# EAGLE design devboard (EAGLE 9.0.1)

## Sheet 1 of 2
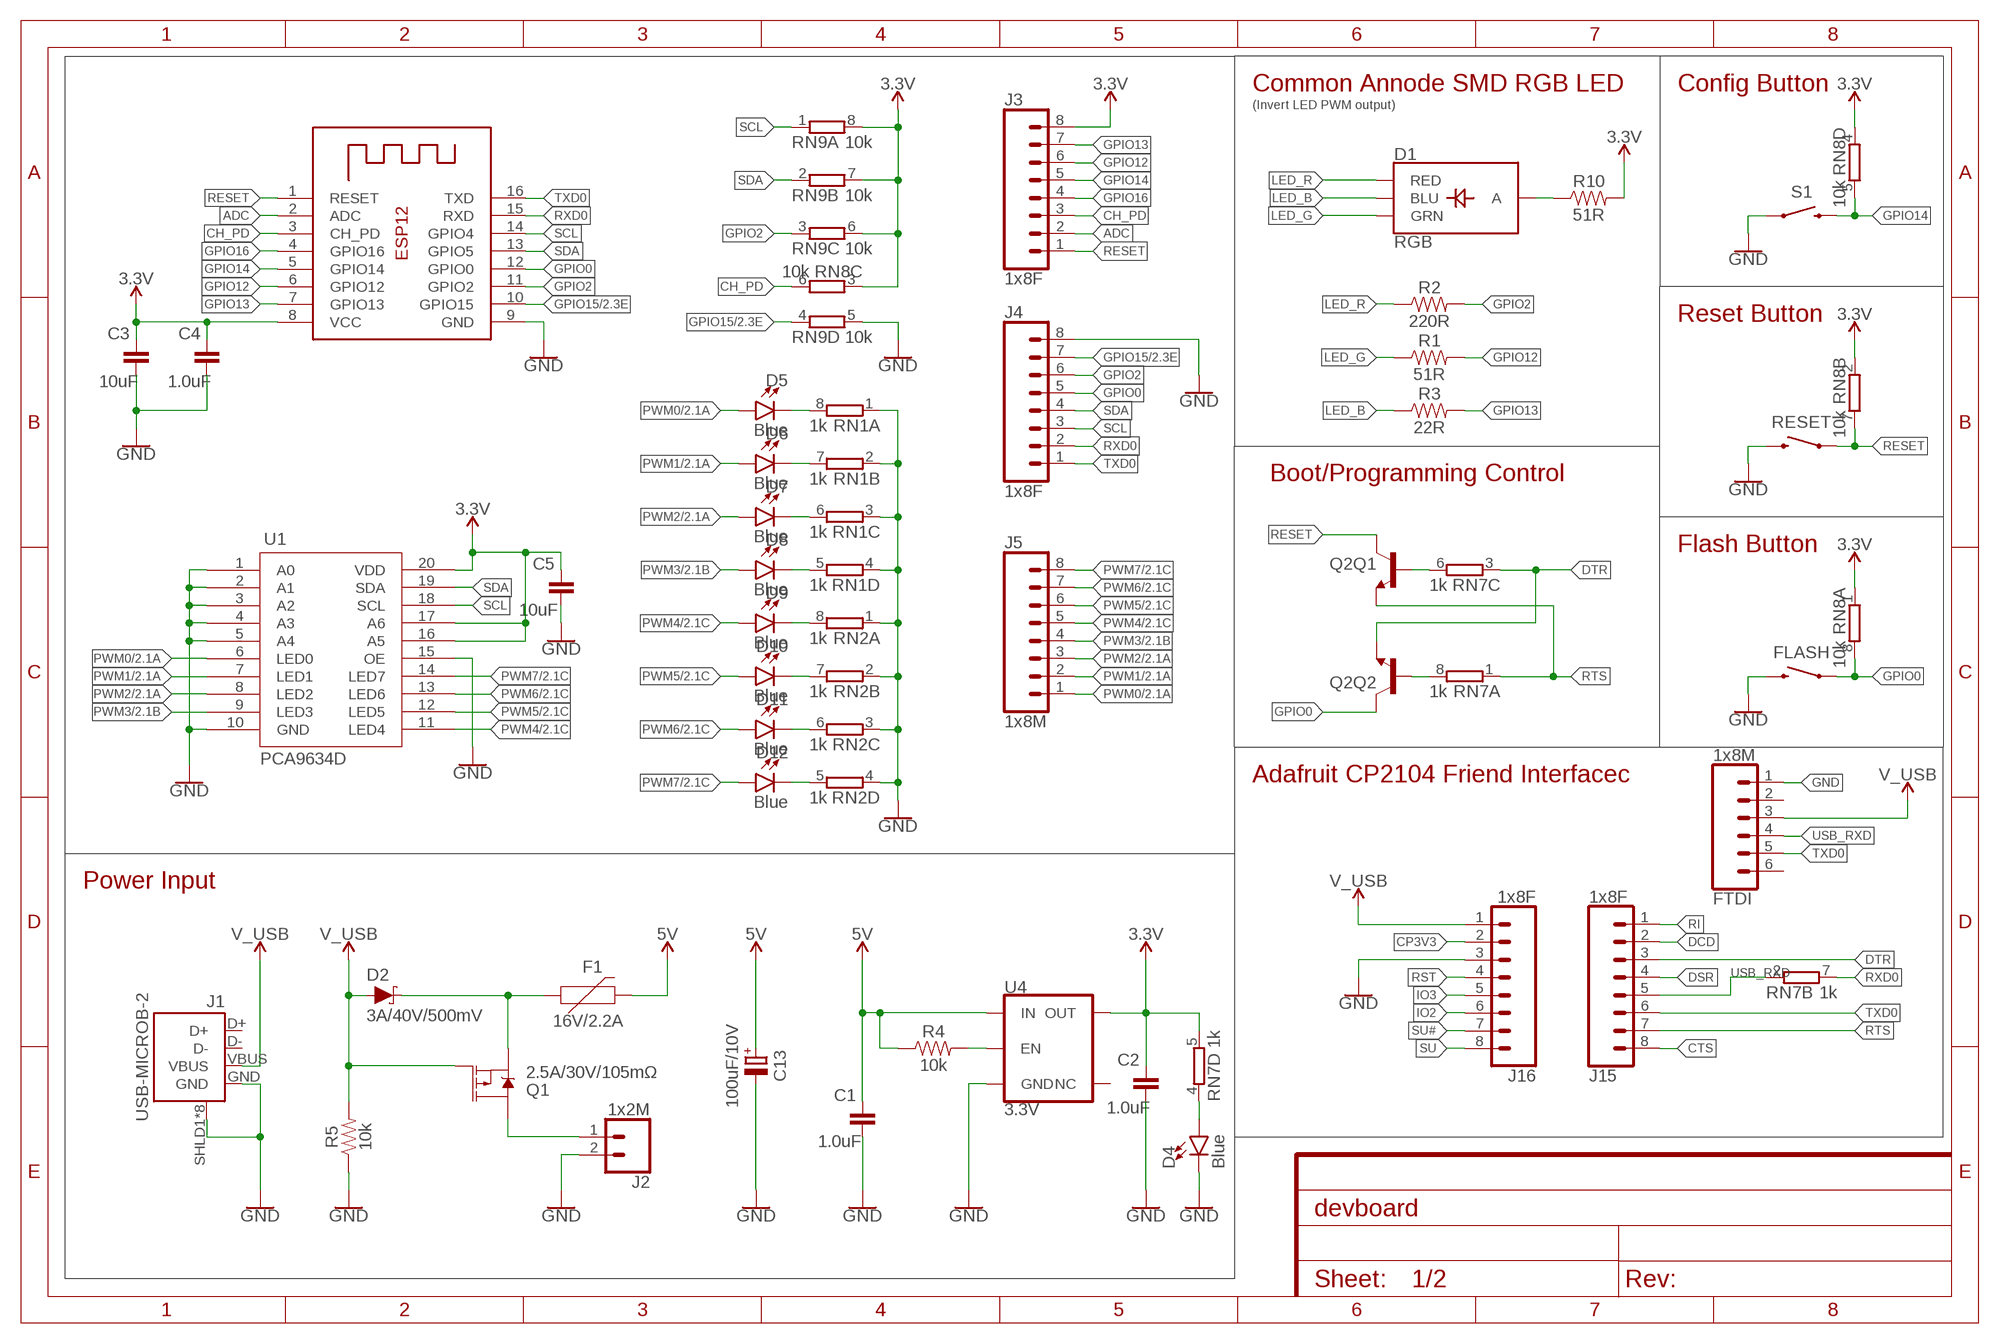
[diagram p0: schematic, sheet 1]
FRAME1 (FRAME-A4L): CNAME: VibHub ESP8266 Devboard; CREVISION: 0.1; DESIGNER: Kadah

### Parts
C1  1.0uF  CAPACITOR-0805  [C0805]
C2  1.0uF  CAPACITOR-0805  [C0805]
C3  10uF  CAPACITOR-0805  [C0805]
C4  1.0uF  CAPACITOR-0805  [C0805]
C5  10uF  CAPACITOR-0805  [C0805]
C13  100uF/10V  CAPACITOR_POLPANASONIC_D  [PANASONIC_D]
D1  RGB  LED-RGB-CAPLCC  [P-LCC-4-3]
D2  3A/40V/500mV  DIODE-SCHOTTKY-B340A  [SMA-DIODE]
D4  Blue  LED0805-NO_OUTLINE  [CHIPLED_0805_NOOUTLINE]
D5  Blue  LED0805-NO_OUTLINE  [CHIPLED_0805_NOOUTLINE]
D6  Blue  LED0805-NO_OUTLINE  [CHIPLED_0805_NOOUTLINE]
D7  Blue  LED0805-NO_OUTLINE  [CHIPLED_0805_NOOUTLINE]
D8  Blue  LED0805-NO_OUTLINE  [CHIPLED_0805_NOOUTLINE]
D9  Blue  LED0805-NO_OUTLINE  [CHIPLED_0805_NOOUTLINE]
D10  Blue  LED0805-NO_OUTLINE  [CHIPLED_0805_NOOUTLINE]
D11  Blue  LED0805-NO_OUTLINE  [CHIPLED_0805_NOOUTLINE]
D12  Blue  LED0805-NO_OUTLINE  [CHIPLED_0805_NOOUTLINE]
F1  16V/2.2A  PPTC1812  [FUSC7035X90]
FLASH  MOMENTARY-SWITCH-SPST-SMD-6.0X3.5MM  [TACTILE_SWITCH_SMD_6.0X3.5MM]
FTDI  1x8M  CONN_06LOCK  [1X06_LOCK]
J1  USB-MICROB-2  [USB-MICROB-10118194]
J2  1x2M  CONN_02LOCK_LONGPADS  [1X02_LOCK_LONGPADS]
J3  1x8F  CONN_08FEMALE_LOCK  [1X08_FEMALE_LOCK]
J4  1x8F  CONN_08FEMALE_LOCK  [1X08_FEMALE_LOCK]
J5  1x8M  CONN_08LOCK  [1X08_LOCK]
J15  1x8F  CONN_08FEMALE_LOCK  [1X08_FEMALE_LOCK]
J16  1x8F  CONN_08FEMALE_LOCK  [1X08_FEMALE_LOCK]
Q1  2.5A/30V/105mΩ  MOSFET_PCH-DMG2307L  [SOT23-3]
Q2  TRANS_NPN_DUAL-MBT3904DW1T1  [SC70-6]
R1  51R  RESISTOR0805  [0805]
R2  220R  RESISTOR0805  [0805]
R3  22R  RESISTOR0805  [0805]
R4  10k  RESISTOR0805  [0805]
R5  10k  RESISTOR0805  [0805]
R10  51R  RESISTOR0805  [0805]
RESET  MOMENTARY-SWITCH-SPST-SMD-6.0X3.5MM  [TACTILE_SWITCH_SMD_6.0X3.5MM]
RN1  1k  4R-NEXB28V  [EXB28V]
RN2  1k  4R-NEXB28V  [EXB28V]
RN7  1k  4R-NEXB28V  [EXB28V]
RN8  10k  4R-NEXB28V  [EXB28V]
RN9  10k  4R-NEXB28V  [EXB28V]
S1  MOMENTARY-SWITCH-SPST-PTH-6.0MM  [TACTILE_SWITCH_PTH_6.0MM]
U1  PCA9634D  PCA963420-SO  [SOIC127P1032X265-20]
U4  3.3V  V_REG_AP2112K-3.3V  [SOT23-5]
X1  ESP12  ESP-12  [ESP-12]

### Nets
3.3V: C2.1 C3.1 C4.1 C5.1 J3.8 R10.2 RN7.5 RN8.1 RN8.2 RN8.3 RN8.4 RN9.6 RN9.7 RN9.8 U1.16(A5) U1.17(A6) U1.20(VDD) U4.5(OUT) X1.8(VCC) ; also sheet 2
5V: C1.1 C13.+ F1.2 R4.1 U4.1(IN) ; also sheet 2
ADC: J3.2 X1.2(ADC)
CH_PD: J3.3 RN8.6 X1.3(CH_PD)
CP3V3: J16.2
CTS: J15.8
DCD: J15.2
DSR: J15.4
DTR: J15.3 Q2.1(Q2:E) RN7.3
GND: C1.2 C2.2 C3.2 C4.2 C5.2 C13.- D4.C FLASH.2 FTDI.1 J1.GND J1.SHLD1(SHIELD) J1.SHLD2(SHIELD) J1.SHLD3(SHIELD) J1.SHLD4(SHIELD) J1.SHLD5(SHIELD) J1.SHLD6(SHIELD) J1.SHLD7(SHIELD) J1.SHLD8(SHIELD) J2.2 J4.8 J16.3 R5.1 RESET.2 RN1.1 RN1.2 RN1.3 RN1.4 RN2.1 RN2.2 RN2.3 RN2.4 RN9.5 S1.1 U1.1(A0) U1.2(A1) U1.3(A2) U1.4(A3) U1.5(A4) U1.10(GND) U1.15(OE) U4.2(GND) X1.9(GND) ; also sheet 2
GPIO0: FLASH.1 J4.5 Q2.6(Q2:C) RN8.8 X1.12(GPIO0)
GPIO2: J4.6 R2.2 RN9.3 X1.11(GPIO2)
GPIO12: J3.6 R1.2 X1.6(GPIO12)
GPIO13: J3.7 R3.2 X1.7(GPIO13)
GPIO14: J3.5 RN8.5 S1.3 X1.5(GPIO14)
GPIO15: J4.7 RN9.4 X1.10(GPIO15) ; also sheet 2
GPIO16: J3.4 X1.4(GPIO16)
IO2: J16.6
IO3: J16.5
LED_B: D1.3(BLU) R3.1
LED_G: D1.2(GRN) R1.1
LED_R: D1.1(RED) R2.1
N$1: R4.2 U4.3(EN)
N$2: D5.C RN1.8
N$3: D6.C RN1.7
N$4: J2.1 Q1.3(D)
N$5: D2.C F1.1 Q1.2(S)
N$6: D7.C RN1.6
N$7: D8.C RN1.5
N$8: D9.C RN2.8
N$9: D10.C RN2.7
N$10: D11.C RN2.6
N$11: D12.C RN2.5
N$12: D1.4(A) R10.1
N$35: Q2.2(Q2:B) RN7.8
N$36: Q2.5(Q1:B) RN7.6
PWM0: D5.A J5.1 U1.6(LED0) ; also sheet 2
PWM1: D6.A J5.2 U1.7(LED1) ; also sheet 2
PWM2: D7.A J5.3 U1.8(LED2) ; also sheet 2
PWM3: D8.A J5.4 U1.9(LED3) ; also sheet 2
PWM4: D9.A J5.5 U1.11(LED4) ; also sheet 2
PWM5: D10.A J5.6 U1.12(LED5) ; also sheet 2
PWM6: D11.A J5.7 U1.13(LED6) ; also sheet 2
PWM7: D12.A J5.8 U1.14(LED7) ; also sheet 2
PWR_LED: D4.A RN7.4
RESET: J3.1 Q2.3(Q1:C) RESET.1 RN8.7 X1.1(RESET)
RI: J15.1
RST: J16.4
RTS: J15.7 Q2.4(Q1:E) RN7.1
RXD0: J4.2 RN7.7 X1.15(RXD)
SCL: J4.3 RN9.1 U1.18(SCL) X1.14(GPIO4)
SDA: J4.4 RN9.2 U1.19(SDA) X1.13(GPIO5)
SU: J16.8
SU#: J16.7
TXD0: FTDI.5 J4.1 J15.6 X1.16(TXD)
USB_RXD: FTDI.4 J15.5 RN7.2
V_USB: D2.A FTDI.3 J1.VBUS J16.1 Q1.1(G) R5.2
Unconnected: FTDI.2 FTDI.6 J1.D+ J1.D- U4.4(NC)

### Notes on the sheet
- Common Annode SMD RGB LED | Config Button
- (Invert LED PWM output)
- Reset Button
- Boot/Programming Control
- Flash Button
- Adafruit CP2104 Friend Interfacec
- Power Input

## Sheet 2 of 2
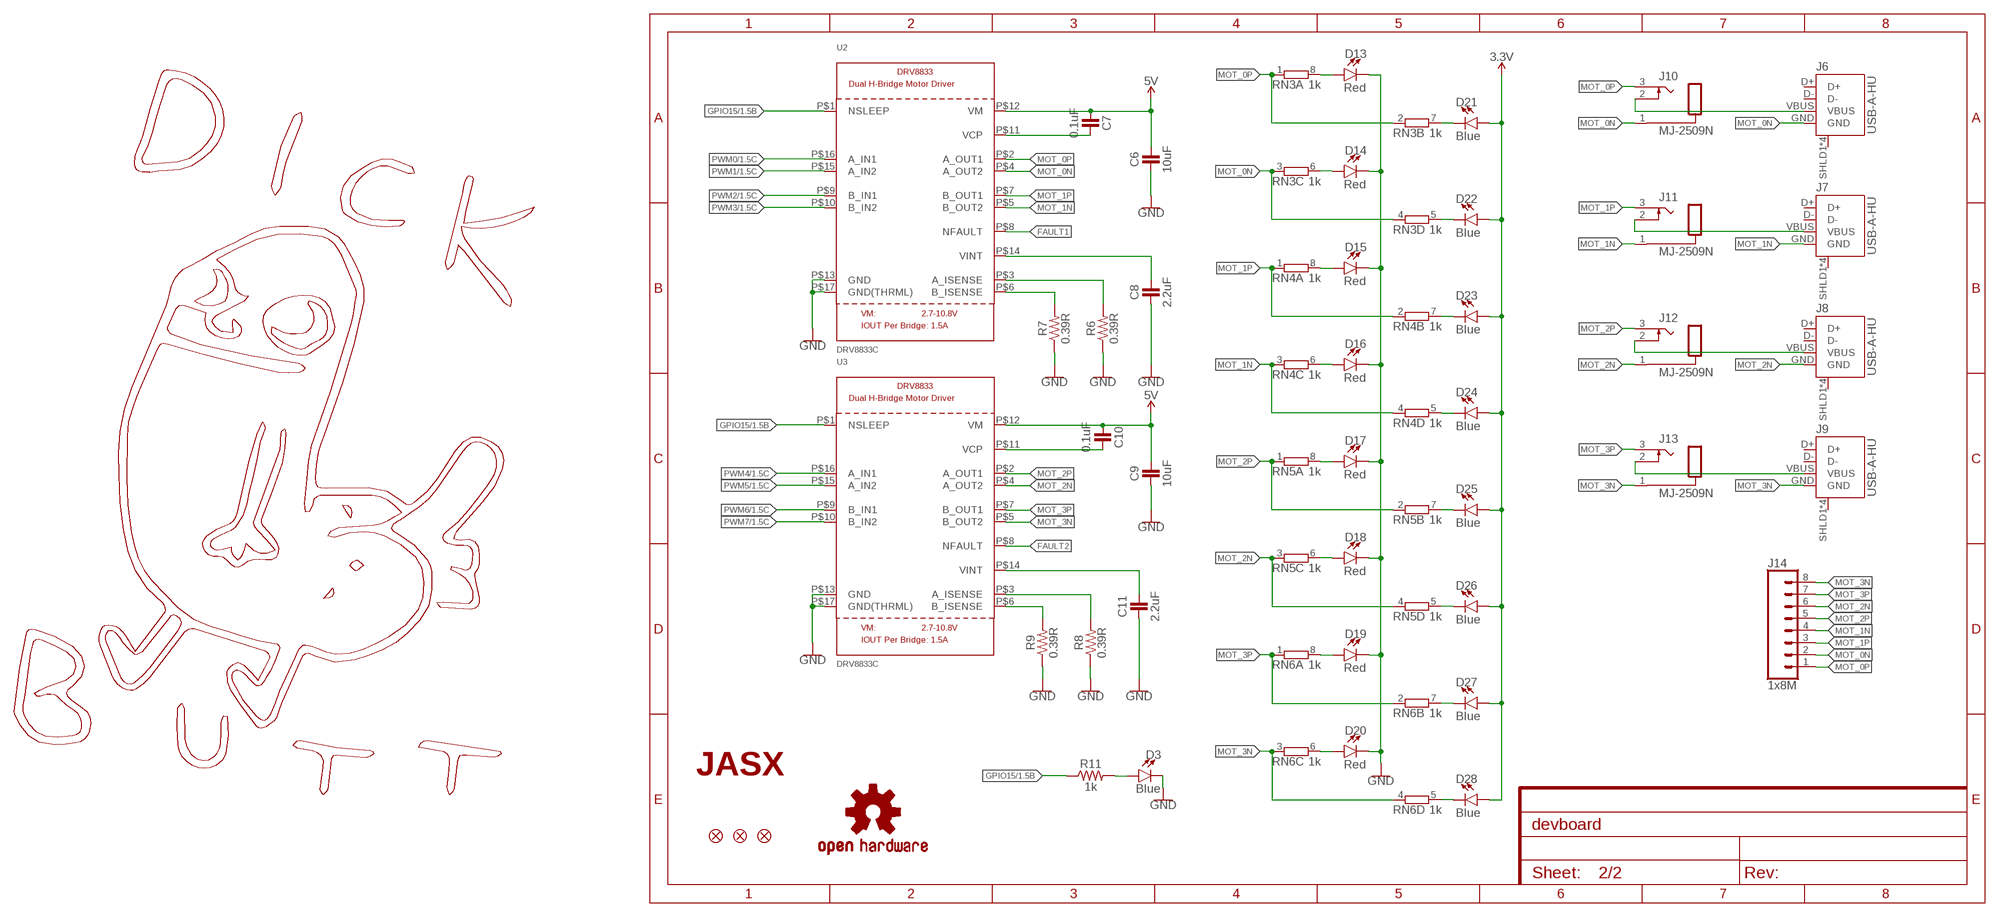
[diagram p1: schematic, sheet 2]

### Parts
C6  10uF  CAPACITOR-0805  [C0805]
C7  0.1uF  CAPACITOR-0805  [C0805]
C8  2.2uF  CAPACITOR-0805  [C0805]
C9  10uF  CAPACITOR-0805  [C0805]
C10  0.1uF  CAPACITOR-0805  [C0805]
C11  2.2uF  CAPACITOR-0805  [C0805]
D3  Blue  LED0805-NO_OUTLINE  [CHIPLED_0805_NOOUTLINE]
D13  Red  LED0805-NO_OUTLINE  [CHIPLED_0805_NOOUTLINE]
D14  Red  LED0805-NO_OUTLINE  [CHIPLED_0805_NOOUTLINE]
D15  Red  LED0805-NO_OUTLINE  [CHIPLED_0805_NOOUTLINE]
D16  Red  LED0805-NO_OUTLINE  [CHIPLED_0805_NOOUTLINE]
D17  Red  LED0805-NO_OUTLINE  [CHIPLED_0805_NOOUTLINE]
D18  Red  LED0805-NO_OUTLINE  [CHIPLED_0805_NOOUTLINE]
D19  Red  LED0805-NO_OUTLINE  [CHIPLED_0805_NOOUTLINE]
D20  Red  LED0805-NO_OUTLINE  [CHIPLED_0805_NOOUTLINE]
D21  Blue  LED0805-NO_OUTLINE  [CHIPLED_0805_NOOUTLINE]
D22  Blue  LED0805-NO_OUTLINE  [CHIPLED_0805_NOOUTLINE]
D23  Blue  LED0805-NO_OUTLINE  [CHIPLED_0805_NOOUTLINE]
D24  Blue  LED0805-NO_OUTLINE  [CHIPLED_0805_NOOUTLINE]
D25  Blue  LED0805-NO_OUTLINE  [CHIPLED_0805_NOOUTLINE]
D26  Blue  LED0805-NO_OUTLINE  [CHIPLED_0805_NOOUTLINE]
D27  Blue  LED0805-NO_OUTLINE  [CHIPLED_0805_NOOUTLINE]
D28  Blue  LED0805-NO_OUTLINE  [CHIPLED_0805_NOOUTLINE]
FD1  FIDUCIAL1X2  [FIDUCIAL-1X2]
FD2  FIDUCIAL1X2  [FIDUCIAL-1X2]
FD3  FIDUCIAL1X2  [FIDUCIAL-1X2]
J6  USB-A-HU  [USB-A-HU]
J7  USB-A-HU  [USB-A-HU]
J8  USB-A-HU  [USB-A-HU]
J9  USB-A-HU  [USB-A-HU]
J10  MJ-2509N  [MJ-2509N]
J11  MJ-2509N  [MJ-2509N]
J12  MJ-2509N  [MJ-2509N]
J13  MJ-2509N  [MJ-2509N]
J14  1x8M  CONN_08LOCK  [1X08_LOCK]
LOGO1  OSHW-LOGOM  [OSHW-LOGO-M]
R6  0.39R  RESISTOR0805  [0805]
R7  0.39R  RESISTOR0805  [0805]
R8  0.39R  RESISTOR0805  [0805]
R9  0.39R  RESISTOR0805  [0805]
R11  1k  RESISTOR0805  [0805]
RN3  1k  4R-NEXB28V  [EXB28V]
RN4  1k  4R-NEXB28V  [EXB28V]
RN5  1k  4R-NEXB28V  [EXB28V]
RN6  1k  4R-NEXB28V  [EXB28V]
U2  DRV8833C  DRV8833  [HTSSOP16]
U3  DRV8833C  DRV8833  [HTSSOP16]
U$1  DICKBUTTCOPPER  [DICKBUTT_COPPER]
U$2  JASX_LOGO_LARGE  [JASX_LOGO]

### Nets
3.3V: D21.A D22.A D23.A D24.A D25.A D26.A D27.A D28.A ; also sheet 1
5V: C6.2 C7.1 C9.2 C10.1 U2.P$12(VM) U3.P$12(VM) ; also sheet 1
A_ISENSE0: R6.2 U2.P$3(A_ISENSE)
A_ISENSE1: R8.2 U3.P$3(A_ISENSE)
B_ISENSE0: R7.2 U2.P$6(B_ISENSE)
B_ISENSE1: R9.2 U3.P$6(B_ISENSE)
FAULT1: U2.P$8(NFAULT)
FAULT2: U3.P$8(NFAULT)
GND: C6.1 C8.1 C9.1 C11.1 D3.C D13.C D14.C D15.C D16.C D17.C D18.C D19.C D20.C R6.1 R7.1 R8.1 R9.1 U2.P$13(GND) U2.P$17(GND(THRML)) U3.P$13(GND) U3.P$17(GND(THRML)) ; also sheet 1
GPIO15: R11.1 U2.P$1(NSLEEP) U3.P$1(NSLEEP) ; also sheet 1
MOT_0N: J6.GND J10.1(S) J14.2 RN3.3 RN3.4 U2.P$4(A_OUT2)
MOT_0P: J10.3(T) J14.1 RN3.1 RN3.2 U2.P$2(A_OUT1)
MOT_1N: J7.GND J11.1(S) J14.4 RN4.3 RN4.4 U2.P$5(B_OUT2)
MOT_1P: J11.3(T) J14.3 RN4.1 RN4.2 U2.P$7(B_OUT1)
MOT_2N: J8.GND J12.1(S) J14.6 RN5.3 RN5.4 U3.P$4(A_OUT2)
MOT_2P: J12.3(T) J14.5 RN5.1 RN5.2 U3.P$2(A_OUT1)
MOT_3N: J9.GND J13.1(S) J14.8 RN6.3 RN6.4 U3.P$5(B_OUT2)
MOT_3P: J13.3(T) J14.7 RN6.1 RN6.2 U3.P$7(B_OUT1)
N$13: D3.A R11.2
N$14: J9.VBUS J13.2(TS)
N$15: D21.C RN3.7
N$16: D13.A RN3.8
N$17: D14.A RN3.6
N$18: D15.A RN4.8
N$19: D16.A RN4.6
N$20: D17.A RN5.8
N$21: D18.A RN5.6
N$22: D19.A RN6.8
N$23: D20.A RN6.6
N$24: D22.C RN3.5
N$25: D23.C RN4.7
N$26: D24.C RN4.5
N$27: D28.C RN6.5
N$28: D27.C RN6.7
N$29: D26.C RN5.5
N$30: D25.C RN5.7
N$32: J6.VBUS J10.2(TS)
N$33: J7.VBUS J11.2(TS)
N$34: J8.VBUS J12.2(TS)
PWM0: U2.P$16(A_IN1) ; also sheet 1
PWM1: U2.P$15(A_IN2) ; also sheet 1
PWM2: U2.P$9(B_IN1) ; also sheet 1
PWM3: U2.P$10(B_IN2) ; also sheet 1
PWM4: U3.P$16(A_IN1) ; also sheet 1
PWM5: U3.P$15(A_IN2) ; also sheet 1
PWM6: U3.P$9(B_IN1) ; also sheet 1
PWM7: U3.P$10(B_IN2) ; also sheet 1
VCP0: C7.2 U2.P$11(VCP)
VCP1: C10.2 U3.P$11(VCP)
VINT0: C8.2 U2.P$14(VINT)
VINT1: C11.2 U3.P$14(VINT)
Unconnected: J6.D+ J6.D- J6.SHLD1(SHIELD) J6.SHLD2(SHIELD) J6.SHLD3(SHIELD) J6.SHLD4(SHIELD) J7.D+ J7.D- J7.SHLD1(SHIELD) J7.SHLD2(SHIELD) J7.SHLD3(SHIELD) J7.SHLD4(SHIELD) J8.D+ J8.D- J8.SHLD1(SHIELD) J8.SHLD2(SHIELD) J8.SHLD3(SHIELD) J8.SHLD4(SHIELD) J9.D+ J9.D- J9.SHLD1(SHIELD) J9.SHLD2(SHIELD) J9.SHLD3(SHIELD) J9.SHLD4(SHIELD)

## Library data of the parts
C1-C11 = vibhud:CAPACITOR: Capacitors ...2.2uF @ 6.3V -> 0402 ...4.7uF @ 6.3V -> 0603 ...10uF @ 16V -> 0805 ...22uF @ 25V -> 1206
C13 = vibhud:CAPACITOR_POL: Polarized Capacitors
D1 = vibhud:LED-RGB-CA: LED-RGB Diffused Common Anode Packages: LED RGB-THRU P-LCC-4-3 LED-TRICOLOR-SMD SparkFun Products: RGB Diffused Common Anode- Diffuse <[https://www.sparkfun.com/products/10821]> RGB Diffused Common Anode - Clear <[https://www.sparkfun.com/products/10820]> Qduino Mini <[https://www.sparkfun.com/products/13614]> Triple Output LED RGB - SMD <https://www.sparkfun.com/products/7844>; PROD_ID: DIO-12986
D2 = vibhud:DIODE-SCHOTTKY: Schottky diode A Schottky diode is a semiconductor diode which has a low forward voltage drop and a very fast switching action.; PROD_ID: DIO-09886
D3-D28 = vibhud:LED: LED (Generic) Standard schematic elements and footprints for 5mm, 3mm, 1206, and 0603 sized LEDs. Generic LEDs with no color specified.
F1 = vibhud:PPTC: Resettable Fuse PPTC Resettable Fuse. Really a sort of resistor with a polymeric positive temperature coefficient whose resistance increases dramatically with an increase in temperature. When heated by the power passing through the resistance rises causing the current to be limited, protecting the circuit. This is achieved by the transition of the polymer from a crystalline to an amorphous state where the conductive carbon separates breaking the conductive pathways found in the cool crystalline structure. When a PPTC cools back down it resumes conducting letting the circuit turn back on. SparkFun Products: SparkFun RedBoard - Programmed with Arduino <https://www.sparkfun.com/products/12757> Pro Micro - 5V/16MHz <https://www.sparkfun.com/products/12640> Arduino Pro 328 - 5V/16MHz <https://www.sparkfun.com/products/10915> MP3 Trigger <https://www.sparkfun.com/products/13720>
FD1-FD3 = vibhud:FIDUCIAL: Fiducial Alignment Points Point-of-reference for pick-and-place machines and other optical instruments.
FLASH RESET = vibhud:MOMENTARY-SWITCH-SPST: Momentary Switch (Pushbutton) - SPST Normally-open (NO) SPST momentary switches (buttons, pushbuttons). Variants PTH-12MM - 12mm square, through-hole Momentary Pushbutton Switch - 12mm Square <https://www.sparkfun.com/products/9190> (COM-09190) PTH-6.0MM, PTH-6.0MM-KIT - 6.0mm square, through-hole Mini Pushbutton Switch <https://www.sparkfun.com/products/97> (COM-00097) KIT package intended for soldering kit's - only one side of pads' copper is exposed. PTH-RIGHT-ANGLE-KIT - Right-angle, through-hole Right Angle Tactile Button <https://www.sparkfun.com/products/10791> - Used on SparkFun BigTime Watch Kit <https://www.sparkfun.com/products/11734> SMD-12MM - 12mm square, surface-mount Tactile Button - SMD (12mm) <https://www.sparkfun.com/products/12993> (COM-12993) Used on SparkFun PicoBoard <https://www.sparkfun.com/products/11888> SMD-4.5MM - 4.5mm Square Trackball Switch Used on SparkFun Blackberry Trackballer Breakout <https://www.sparkfun.com/products/13169> SMD-4.6MMX2.8MM - 4.60mm x 2.80mm, surface mount Used on SparkFun SAMD21 Mini Breakout <https://www.sparkfun.com/products/13664> SMD-5.2MM, SMD-5.2-REDUNDANT - 5.2mm square, surface-mount Mini Pushbutton Switch - SMD <https://www.sparkfun.com/products/8720> (COM-08720) Used on Arduino Pro Mini <https://www.sparkfun.com/products/11114> REDUNDANT package connects both switch circuits together SMD-6.0X3.5MM - 6.0 x 3.5mm, surface mount Momentary Reset Switch SMD <https://www.sparkfun.com/products/8229> (COM-08229) SMD-6.2MM-TALL - 6.2mm square, surface mount Tactile Button - SMD (6mm) <https://www.sparkfun.com/products/12992> Used on SparkFun Digital Sandbox <https://www.sparkfun.com/products/12651> SMD-RIGHT-ANGLE - Right-angle, surface mount Used on SparkFun Block for Intel® Edison - Arduino <https://www.sparkfun.com/products/13036>; PROD_ID: SWCH-00815; SF_SKU: COM-08229
FTDI = vibhud:CONN_06: Multi connection point. Often used as Generic Header-pin footprint for 0.1 inch spaced/style header connections On any of the 0.1 inch spaced packages, you can populate with these: Break Away Headers - Straight <https://www.sparkfun.com/products/116> (PRT-00116) Break Away Male Headers - Right Angle <https://www.sparkfun.com/products/553> (PRT-00553) Female Headers <https://www.sparkfun.com/products/115> (PRT-00115) Break Away Headers - Machine Pin <https://www.sparkfun.com/products/117> (PRT-00117) Break Away Female Headers - Swiss Machine Pin <https://www.sparkfun.com/products/743> (PRT-00743) Arduino Stackable Header - 6 Pin <https://www.sparkfun.com/products/9280> (PRT-09280) For SCREWTERMINALS and SPRING TERMINALS visit here: Screw Terimnals on SparkFun.com <https://www.sparkfun.com/search/results?term=Screw+Terminals> (5mm/3.5mm/2.54mm spacing) This device is also useful as a general connection point to wire up your design to another part of your project. Our various solder wires solder well into these plated through hole pads. Hook-Up Wire - Assortment (Stranded, 22 AWG) <https://www.sparkfun.com/products/11375> (PRT-11375) Hook-Up Wire - Assortment (Solid Core, 22 AWG) <https://www.sparkfun.com/products/11367> (PRT-11367) View the entire wire category on our website here <https://www.sparkfun.com/categories/141>
J1 = vibhud:USB: USB Connectors; DIGIKEY: 609-4618-6-ND
J2 = vibhud:CONN_02: Multi connection point. Often used as Generic Header-pin footprint for 0.1 inch spaced/style header connections On any of the 0.1 inch spaced packages, you can populate with these: Break Away Headers - Straight <https://www.sparkfun.com/products/116> (PRT-00116) Break Away Male Headers - Right Angle <https://www.sparkfun.com/products/553> (PRT-00553) Female Headers <https://www.sparkfun.com/products/115> (PRT-00115) Break Away Headers - Machine Pin <https://www.sparkfun.com/products/117> (PRT-00117) Break Away Female Headers - Swiss Machine Pin <https://www.sparkfun.com/products/743> (PRT-00743) For SCREWTERMINALS and SPRING TERMINALS visit here: Screw Terimnals on SparkFun.com <https://www.sparkfun.com/search/results?term=Screw+Terminals> (5mm/3.5mm/2.54mm spacing) This device is also useful as a general connection point to wire up your design to another part of your project. Our various solder wires solder well into these plated through hole pads. Hook-Up Wire - Assortment (Stranded, 22 AWG) <https://www.sparkfun.com/products/11375> (PRT-11375) Hook-Up Wire - Assortment (Solid Core, 22 AWG) <https://www.sparkfun.com/products/11367> (PRT-11367) View the entire wire category on our website here <https://www.sparkfun.com/categories/141> Special notes: Molex polarized connector foot print use with: PRT-08233 with associated crimp pins and housings. 2.54_SCREWTERM for use with PRT-10571. 3.5mm Screw Terminal footprints for PRT-08084 5mm Screw Terminal footprints for use with PRT-08432
J3 J4 J15 J16 = vibhud:CONN_08: Multi connection point. Often used as Generic Header-pin footprint for 0.1 inch spaced/style header connections On any of the 0.1 inch spaced packages, you can populate with these: Break Away Headers - Straight <https://www.sparkfun.com/products/116> (PRT-00116) Break Away Male Headers - Right Angle <https://www.sparkfun.com/products/553> (PRT-00553) Female Headers <https://www.sparkfun.com/products/115> (PRT-00115) Break Away Headers - Machine Pin <https://www.sparkfun.com/products/117> (PRT-00117) Break Away Female Headers - Swiss Machine Pin <https://www.sparkfun.com/products/743> (PRT-00743) Arduino Stackable Header - 8 Pin <https://www.sparkfun.com/products/9279> (PRT-09279) For SCREWTERMINALS and SPRING TERMINALS visit here: Screw Terimnals on SparkFun.com <https://www.sparkfun.com/search/results?term=Screw+Terminals> (5mm/3.5mm/2.54mm spacing) This device is also useful as a general connection point to wire up your design to another part of your project. Our various solder wires solder well into these plated through hole pads. Hook-Up Wire - Assortment (Stranded, 22 AWG) <https://www.sparkfun.com/products/11375> (PRT-11375) Hook-Up Wire - Assortment (Solid Core, 22 AWG) <https://www.sparkfun.com/products/11367> (PRT-11367) View the entire wire category on our website here <https://www.sparkfun.com/categories/141> Special notes: Molex polarized connector foot print use with SKU : PRT-08231 with associated crimp pins and housings. 1MM SMD Version SKU: PRT-10208 NOTES ON THE VARIANTS LOCK and LOCK_LONGPADS... This footprint was designed to help hold the alignment of a through-hole component (i.e. 6-pin header) while soldering it into place. You may notice that each hole has been shifted either up or down by 0.005 of an inch from it's more standard position (which is a perfectly straight line). This slight alteration caused the pins (the squares in the middle) to touch the edges of the holes. Because they are alternating, it causes a "brace" to hold the component in place. 0.005 has proven to be the perfect amount of "off-center" position when using our standard breakaway headers. Although looks a little odd when you look at the bare footprint, once you have a header in there, the alteration is very hard to notice. Also,if you push a header all the way into place, it is covered up entirely on the bottom side.; PROD_ID: CONN-09233; SF_ID: PRT-09279
J5 J14 = vibhud:CONN_08: Multi connection point. Often used as Generic Header-pin footprint for 0.1 inch spaced/style header connections On any of the 0.1 inch spaced packages, you can populate with these: Break Away Headers - Straight <https://www.sparkfun.com/products/116> (PRT-00116) Break Away Male Headers - Right Angle <https://www.sparkfun.com/products/553> (PRT-00553) Female Headers <https://www.sparkfun.com/products/115> (PRT-00115) Break Away Headers - Machine Pin <https://www.sparkfun.com/products/117> (PRT-00117) Break Away Female Headers - Swiss Machine Pin <https://www.sparkfun.com/products/743> (PRT-00743) Arduino Stackable Header - 8 Pin <https://www.sparkfun.com/products/9279> (PRT-09279) For SCREWTERMINALS and SPRING TERMINALS visit here: Screw Terimnals on SparkFun.com <https://www.sparkfun.com/search/results?term=Screw+Terminals> (5mm/3.5mm/2.54mm spacing) This device is also useful as a general connection point to wire up your design to another part of your project. Our various solder wires solder well into these plated through hole pads. Hook-Up Wire - Assortment (Stranded, 22 AWG) <https://www.sparkfun.com/products/11375> (PRT-11375) Hook-Up Wire - Assortment (Solid Core, 22 AWG) <https://www.sparkfun.com/products/11367> (PRT-11367) View the entire wire category on our website here <https://www.sparkfun.com/categories/141> Special notes: Molex polarized connector foot print use with SKU : PRT-08231 with associated crimp pins and housings. 1MM SMD Version SKU: PRT-10208 NOTES ON THE VARIANTS LOCK and LOCK_LONGPADS... This footprint was designed to help hold the alignment of a through-hole component (i.e. 6-pin header) while soldering it into place. You may notice that each hole has been shifted either up or down by 0.005 of an inch from it's more standard position (which is a perfectly straight line). This slight alteration caused the pins (the squares in the middle) to touch the edges of the holes. Because they are alternating, it causes a "brace" to hold the component in place. 0.005 has proven to be the perfect amount of "off-center" position when using our standard breakaway headers. Although looks a little odd when you look at the bare footprint, once you have a header in there, the alteration is very hard to notice. Also,if you push a header all the way into place, it is covered up entirely on the bottom side.
J6-J9 = vibhud:USB: USB Connectors
J10-J13 = vibhud:MJ-2509N: Mono Audio Jack, 2.5 MM
LOGO1 = vibhud:OSHW-LOGO: Open-Source Hardware (OSHW) Logo This logo indicates the piece of hardware it is found on incorporates a OSHW license and/or adheres to the definition of open source hardware found here: http://freedomdefined.org/OSHW
Q1 = vibhud:MOSFET_PCH: P-channel MOSFETs Voltage controlled devices that allow control of high current outputs. SparkFun Products: SparkFun ESP32 Thing <https://www.sparkfun.com/products/13907> SparkFun ESP8266 Thing <https://www.sparkfun.com/products/13231>; PROD_ID: TRANS-11308
Q2 = vibhud:TRANS_NPN_DUAL: Dual NPN Transistors in Single Package The MBT3904W1 puts two general purpose 3904 NPN transistors in a single package. Datasheet <http://www.onsemi.com/pub_link/Collateral/MBT3904DW1T1-D.PDF> SparkFun Products: SparkFun ESP32 Thing <https://www.sparkfun.com/products/13907>; PROD_ID: TRANS-13337
R1-R11 = vibhud:RESISTOR: Generic Resistor Package
RN1-RN9 = vibhud:4R-N: Array Chip Resistor Source: RS Component / Phycomp; OC_FARNELL: unknown; OC_NEWARK: unknown
S1 = vibhud:MOMENTARY-SWITCH-SPST: Momentary Switch (Pushbutton) - SPST Normally-open (NO) SPST momentary switches (buttons, pushbuttons). Variants PTH-12MM - 12mm square, through-hole Momentary Pushbutton Switch - 12mm Square <https://www.sparkfun.com/products/9190> (COM-09190) PTH-6.0MM, PTH-6.0MM-KIT - 6.0mm square, through-hole Mini Pushbutton Switch <https://www.sparkfun.com/products/97> (COM-00097) KIT package intended for soldering kit's - only one side of pads' copper is exposed. PTH-RIGHT-ANGLE-KIT - Right-angle, through-hole Right Angle Tactile Button <https://www.sparkfun.com/products/10791> - Used on SparkFun BigTime Watch Kit <https://www.sparkfun.com/products/11734> SMD-12MM - 12mm square, surface-mount Tactile Button - SMD (12mm) <https://www.sparkfun.com/products/12993> (COM-12993) Used on SparkFun PicoBoard <https://www.sparkfun.com/products/11888> SMD-4.5MM - 4.5mm Square Trackball Switch Used on SparkFun Blackberry Trackballer Breakout <https://www.sparkfun.com/products/13169> SMD-4.6MMX2.8MM - 4.60mm x 2.80mm, surface mount Used on SparkFun SAMD21 Mini Breakout <https://www.sparkfun.com/products/13664> SMD-5.2MM, SMD-5.2-REDUNDANT - 5.2mm square, surface-mount Mini Pushbutton Switch - SMD <https://www.sparkfun.com/products/8720> (COM-08720) Used on Arduino Pro Mini <https://www.sparkfun.com/products/11114> REDUNDANT package connects both switch circuits together SMD-6.0X3.5MM - 6.0 x 3.5mm, surface mount Momentary Reset Switch SMD <https://www.sparkfun.com/products/8229> (COM-08229) SMD-6.2MM-TALL - 6.2mm square, surface mount Tactile Button - SMD (6mm) <https://www.sparkfun.com/products/12992> Used on SparkFun Digital Sandbox <https://www.sparkfun.com/products/12651> SMD-RIGHT-ANGLE - Right-angle, surface mount Used on SparkFun Block for Intel® Edison - Arduino <https://www.sparkfun.com/products/13036>; PROD_ID: SWCH-08441; SF_SKU: COM-00097
U1 = vibhud:PCA9634
U2 U3 = vibhud:DRV8833: DRV8833 Dual H-Bridge Motor Driver -- HTSSOP Package
U4 = vibhud:V_REG_AP2112: AP2112 - 600mA CMOS LDO Regulator w/ Enable The AP2112 is CMOS process low dropout linear regulator with enable function, the regulator delivers a guaranteed 600mA (min.) continuous load current. Features Output Voltage Accuracy: ±1.5% Output Current: 600mA (Min.) Foldback Short Current Protection: 50mA Enable Function to Turn ON/OFF VOUT Low Dropout Voltage (3.3V): 250mV (Typ.) @IOUT=600mA Excellent Load Regulation: 0.2%/A (Typ.) Excellent Line Regulation: 0.02%/V (Typ.) Low Quiescent Current: 55μA (Typ.) Low Standby Current: 0.01μA (Typ.) Low Output Noise: 50μVRMS PSRR: 100Hz -65dB, 1kHz -65dB OTSD Protection Stable with 1.0μF Flexible Cap: Ceramic, Tantalum and Aluminum Electrolytic Operation Temperature Range: -40°C to 85°C ESD: MM 400V, HBM 4000V; PROD_ID: VREG-12457
U$1 = vibhud:DICKBUTT
U$2 = vibhud:JASX_LOGO
X1 = vibhud:ESP-12

## Board
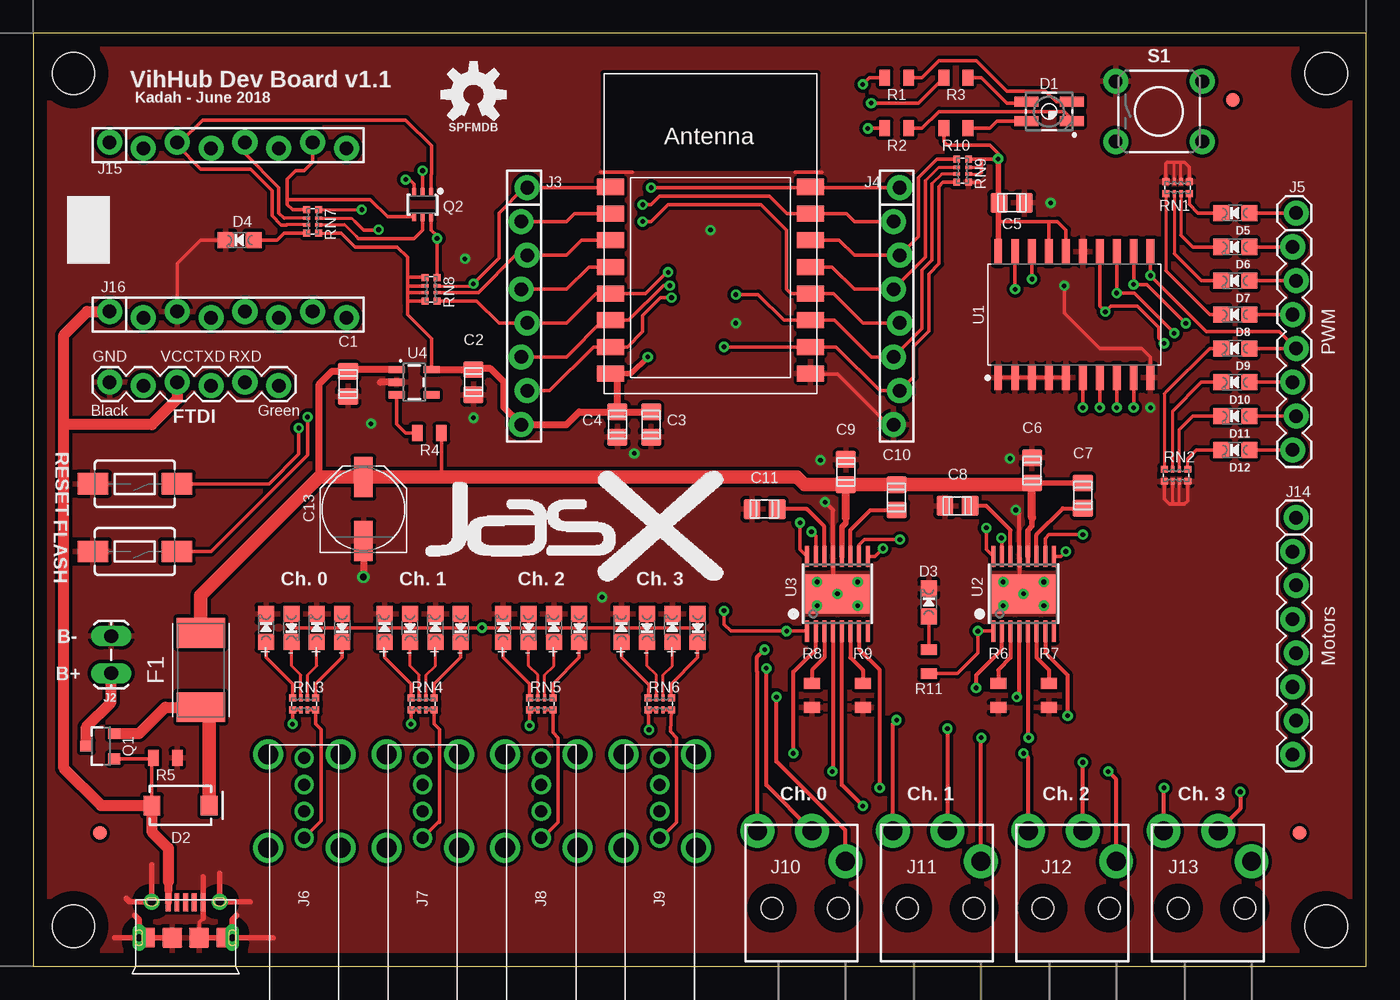
[diagram p2: board, top side]
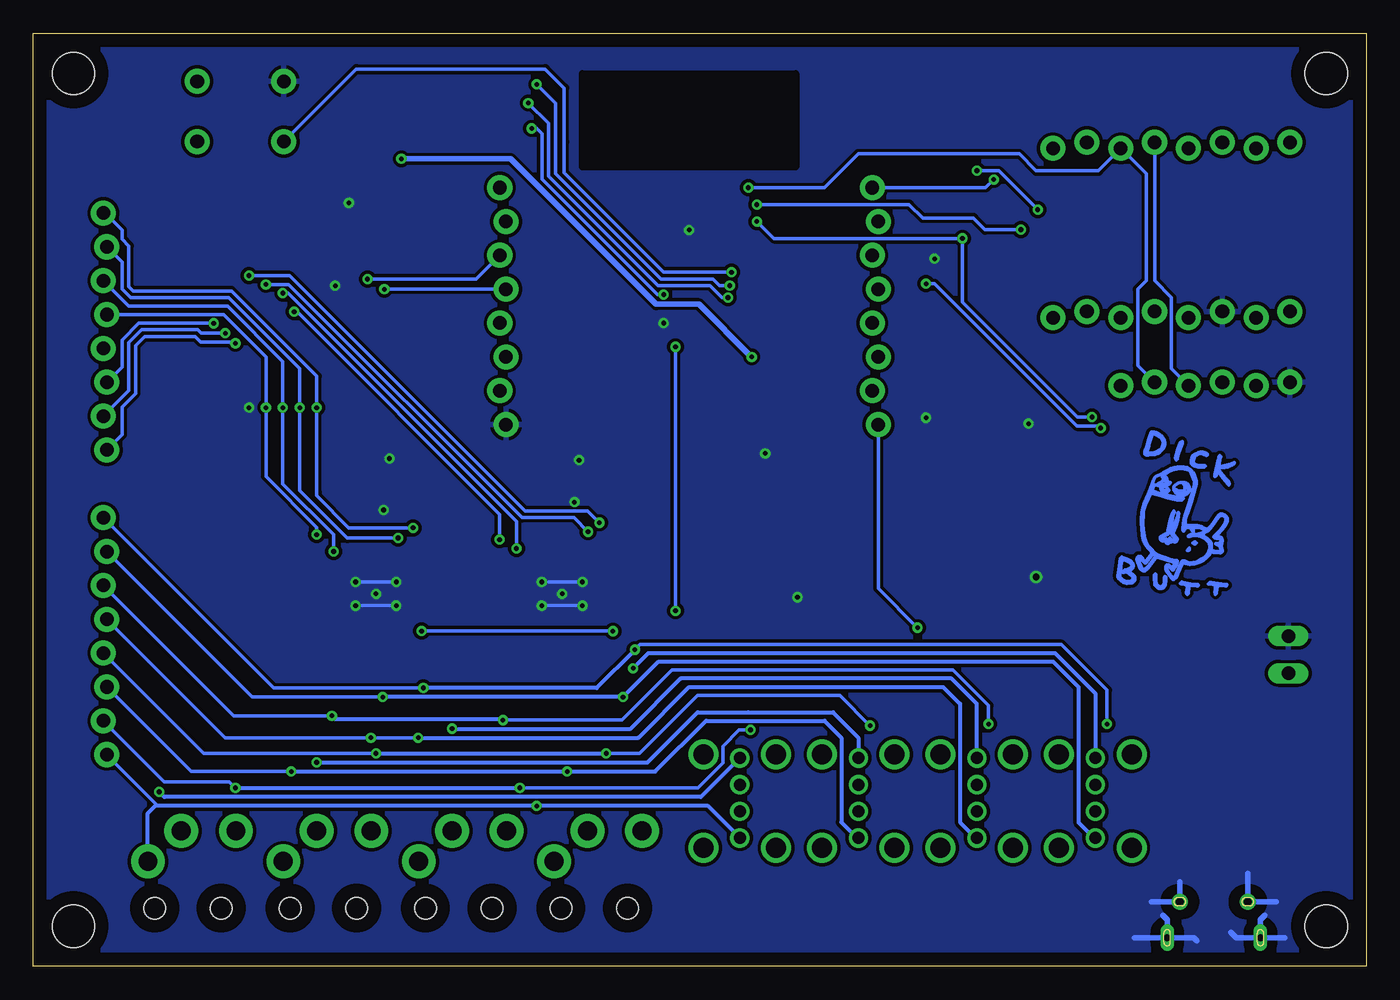
[diagram p3: board, bottom side, seen from below]

Size 100 x 70 mm. Coordinates in mm from the lower left corner, seen from the top.
Outline: 0,0 100,0 100,70 0,70 0,0
Copper layers (1*16): Top 0.035mm / dielectric 1.5mm / Bottom 0.035mm
Design rules "default *": minimum track width 6mil, minimum drill 0.35mm, track to track 10mil, track to pad 6mil, pad to pad 6mil, via to via 6mil, smd to smd 6mil, copper to edge 40mil, drill to drill 6mil, minimum pad ring 10mil, minimum via ring 8mil, stop-mask expansion 4mil, vias tented up to drill 0mil, thermal gap 10mil
Holes 3.17 mm at 97,3 3,3 3,67 97,67

### Footprints (pad centres in the part's own frame; a part is rotated, then mirrored left to right if it is on the bottom)
C0805 = smd 1.5 x 1.25: 1 0,0.95; 2 0,-0.95
PANASONIC_D = smd 3 x 1.4: + 2.4,0; - -2.4,0
P-LCC-4-3 = smd 1.8 x 0.75: 1 -1.7,0.725; 2 -1.7,-0.725; 3 1.7,-0.725; 4 1.7,0.725
SMA-DIODE = smd 1.27 x 1.47: A -2.15,0; C 2.15,0
CHIPLED_0805_NOOUTLINE = smd 1.2 x 1.2: A 0,-1.05; C 0,1.05
FUSC7035X90 = smd 2.242 x 3.612: 1 -2.79,0; 2 2.79,0
FIDUCIAL-1X2 = smd 1 x 1: 1 0,0
TACTILE_SWITCH_SMD_6.0X3.5MM = smd 2.3 x 1.6: 1 -3.15,0; 2 3.15,0
1X06_LOCK = drill 1.016 pad 1.88: 1 0,0; 2 2.54,-0.254; 3 5.08,0; 4 7.62,-0.254; 5 10.16,0; 6 12.7,-0.254
USB-MICROB-10118194 = smd 1.3 x 0.4: D+ -2.5,0; D- -2.5,-0.65; GND -2.5,1.3; ID -2.5,0.65; VBUS -2.5,-1.3 | drill 0.6 pad 1.2: SHLD1 -2.55,2.55; SHLD2 -2.55,-2.55 | drill 0.5 pad 0.8 long: SHLD3 0.15,3.5; SHLD4 0.15,-3.5 | smd 1.5 x 1.1: SHLD5 0.15,2.85; SHLD6 0.15,-2.85 | smd 1.5 x 1.5: SHLD7 0.15,1; SHLD8 0.15,-1
1X02_LOCK_LONGPADS = drill 1.016 long: 1 -0.127,0; 2 2.667,0
1X08_FEMALE_LOCK = drill 1.016 pad 1.88: 1 0,0.229; 2 2.54,-0.229; 3 5.08,0.229; 4 7.62,-0.229; 5 10.16,0.229; 6 12.7,-0.229; 7 15.24,0.229; 8 17.78,-0.229
1X08_LOCK = drill 1.016 pad 1.88: 1 0,0.127; 2 2.54,-0.127; 3 5.08,0.127; 4 7.62,-0.127; 5 10.16,0.127; 6 12.7,-0.127; 7 15.24,0.127; 8 17.78,-0.127
USB-A-HU = drill 0.9 pad 1.45: D+ -2.73,0; D- -4.73,0; GND -0.73,0; VBUS -6.73,0 | drill 1.5: SHLD1 -7,2.72; SHLD2 -7,-2.72; SHLD3 0,-2.72; SHLD4 0,2.72
MJ-2509N = drill 1.422 pad 2.54: 1 2.5,-2.3; 2 0,0; 3 -4.1,0 | hole 1.626: -3,-5.8; 2,-5.8
SOT23-3 = smd 0.8 x 0.9: 1 -0.95,-1; 2 0.95,-1; 3 0,1.1
SC70-6 = smd 0.3 x 0.66: 1 -0.65,-0.92; 2 0,-0.92; 3 0.65,-0.92; 4 0.65,0.92; 5 0,0.92; 6 -0.65,0.92
0805 = smd 0.8 x 1.2: 1 -0.9,0; 2 0.9,0
EXB28V = smd 0.525 x 0.5: 1 -0.875,-0.45; 4 0.875,-0.45; 5 0.875,0.45; 8 -0.875,0.45 | smd 0.25 x 0.5: 2 -0.25,-0.45; 3 0.25,-0.45; 6 0.25,0.45; 7 -0.25,0.45
TACTILE_SWITCH_PTH_6.0MM = drill 1.016 pad 1.88: 1 -3.251,2.261; 2 3.251,2.261; 3 -3.251,-2.261; 4 3.251,-2.261
SOIC127P1032X265-20 = smd 1.916 x 0.592: 1 -4.722,5.715; 2 -4.722,4.445; 3 -4.722,3.175; 4 -4.722,1.905; 5 -4.722,0.635; 6 -4.722,-0.635; 7 -4.722,-1.905; 8 -4.722,-3.175; 9 -4.722,-4.445; 10 -4.722,-5.715; 11 4.722,-5.715; 12 4.722,-4.445; 13 4.722,-3.175; 14 4.722,-1.905; 15 4.722,-0.635; 16 4.722,0.635; 17 4.722,1.905; 18 4.722,3.175; 19 4.722,4.445; 20 4.722,5.715
HTSSOP16 = smd 0.3 x 1.6: P$1 -2.275,-2.8; P$2 -1.625,-2.8; P$3 -0.975,-2.8; P$4 -0.325,-2.8; P$5 0.325,-2.8; P$6 0.975,-2.8; P$7 1.625,-2.8; P$8 2.275,-2.8; P$9 2.275,2.8; P$10 1.625,2.8; P$11 0.975,2.8; P$12 0.325,2.8; P$13 -0.325,2.8; P$14 -0.975,2.8; P$15 -1.625,2.8; P$16 -2.275,2.8 | smd 4.8 x 2.921: P$17 0,0
SOT23-5 = smd 0.55 x 1.2: 1 -0.95,-1.3; 2 0,-1.3; 3 0.95,-1.3; 4 0.95,1.3; 5 -0.95,1.3
ESP-12 = smd 2 x 1.2: 1 -7.5,4.5; 2 -7.5,2.5; 3 -7.5,0.5; 4 -7.5,-1.5; 5 -7.5,-3.5; 6 -7.5,-5.5; 7 -7.5,-7.5; 8 -7.5,-9.5; 9 7.5,-9.5; 10 7.5,-7.5; 11 7.5,-5.5; 12 7.5,-3.5; 13 7.5,-1.5; 14 7.5,0.5; 15 7.5,2.5; 16 7.5,4.5

### Placement (x,y rotation side)
C1  23.62,43.69 0 top
C2  33.02,43.81 0 top
C3  46.35,40.64 0 top
C4  43.81,40.64 0 top
C5  73.41,57.28 90 top
C6  74.93,37.21 0 top
C7  78.74,35.31 0 top
C8  69.34,34.54 90 top
C9  60.96,37.08 0 top
C10  64.77,35.18 0 top
C11  54.86,34.29 90 top
C13  24.77,34.29 90 top
D1  76.2,64.14 180 top
D2  11.05,12.06 0 top
D3  67.18,27.3 0 top
D4  15.49,54.48 90 top
D5  90.17,56.52 90 top
D6  90.17,53.98 90 top
D7  90.17,51.44 90 top
D8  90.17,48.9 90 top
D9  90.17,46.35 90 top
D10  90.17,43.81 90 top
D11  90.17,41.27 90 top
D12  90.17,38.73 90 top
D13  17.46,25.4 0 top
D14  21.27,25.4 0 top
D15  26.35,25.4 0 top
D16  30.16,25.4 0 top
D17  35.24,25.4 0 top
D18  39.05,25.4 0 top
D19  44.13,25.4 0 top
D20  47.94,25.4 0 top
D21  19.37,25.4 180 top
D22  23.18,25.4 180 top
D23  28.26,25.4 180 top
D24  32.07,25.4 180 top
D25  37.15,25.4 180 top
D26  40.96,25.4 180 top
D27  46.04,25.4 180 top
D28  49.85,25.4 180 top
F1  12.57,22.23 90 top
FD1  5,10 0 top
FD2  95,10 0 top
FD3  90,65 0 top
FLASH  7.62,31.11 180 top
FTDI  5.71,43.81 0 top
J1  11.43,2.29 270 top
J2  5.84,22.1 90 top
J3  36.83,58.42 270 top
J4  64.77,58.42 270 top
J5  94.61,56.52 270 top
J6  20.32,8.89 270 top
J7  29.21,8.89 270 top
J8  38.1,8.89 270 top
J9  46.99,8.89 270 top
J10  58.42,10.16 0 top
J11  68.58,10.16 0 top
J12  78.74,10.16 0 top
J13  88.9,10.16 0 top
J14  94.61,33.66 270 top
J15  5.71,61.59 0 top
J16  5.71,48.9 0 top
LOGO1  33.02,65.41 0 top
Q1  5.08,16.51 90 top
Q2  29.21,57.15 180 top
R1  64.77,66.67 180 top
R2  64.77,62.87 180 top
R3  69.22,66.67 180 top
R4  29.72,40.01 180 top
R5  9.91,15.62 180 top
R6  72.39,20.32 90 top
R7  76.2,20.32 90 top
R8  58.42,20.32 90 top
R9  62.23,20.32 90 top
R10  69.22,62.87 180 top
R11  67.18,22.86 90 top
RESET  7.62,36.2 180 top
RN1  85.85,58.42 180 top
RN2  85.72,36.83 0 top
RN3  20.32,19.68 0 top
RN4  29.21,19.68 0 top
RN5  38.1,19.68 0 top
RN6  46.99,19.68 0 top
RN7  20.95,55.88 270 top
RN8  29.84,50.8 270 top
RN9  69.72,59.69 270 top
S1  84.45,64.14 0 top
U1  78.11,48.9 90 top
U2  74.3,27.94 0 top
U3  60.33,27.94 0 top
U4  28.57,43.81 270 top
U$1  14.61,31.11 0 bottom
U$2  41.02,32.51 0 top
X1  50.8,53.98 0 top

### Tracks (layer width: path | path; a pad name or v marks a point on that pad's centre or on a via)
3.3V  (via drill 0.35)
  Top 0.229: RN7.5 22.72,55.01 22.73,54.99 | RN9.7 71.12,59.94 | RN9.6 71,59.44 71.12,59.56 | 71.12,59.69 71.12,60.56
  Top 0.254: D21.A 19.37,25.72 19.68,25.4 23.11,25.4 | 45.97,25.4 49.53,25.4 49.85,25.72 D28.A | 45.97,25.4 40.89,25.4 | 40.89,25.4 37.08,25.4 | 37.08,25.4 v33.66,25.4 32,25.4 | 32,25.4 28.32,25.4 | 28.32,25.4 23.11,25.4 | D27.A 46.04,25.46 45.97,25.4 | D26.A 40.96,25.46 40.89,25.4 | D25.A 37.15,25.46 37.08,25.4 | D24.A 32.07,25.46 32,25.4 | D23.A 28.26,25.46 28.32,25.4 | D22.A 23.18,25.46 23.11,25.4 | RN9.8 71.12,60.56 | 71.12,60.56 72.38,60.56 v72.39,60.58 72.39,60.96 71.75,61.59 68.58,61.59 68.31,61.86 R10.2 | 71.12,59.94 | 71.12,60.56 71.12,59.94 | 71.12,59.56 71.12,59.69 71.12,59.94 | RN8.4 28.21,49.92 28.07,49.78 | 28.07,49.78 28.07,48.9 29.88,47.09 U4.5 | 28.07,49.78 28.07,50.55 | 28.07,50.55 28.07,51.05 | 28.07,51.05 28.07,51.69 | 28.07,51.69 29.38,51.69 RN8.1 | RN8.2 28.07,51.05 | RN8.3 28.07,50.55 | 28.07,51.69 28.07,53.21 27.3,53.98 24.13,53.98 23.1,55.01 22.72,55.01 | 72.39,55.88 76.2,55.88 | 76.2,55.88 76.83,55.88 77.47,55.24 U1.16 | U1.17 76.2,55.88
  Top 0.406: 43.18,44.35 X1.8 44.86,44.48 v46.1,45.72 | v72.39,60.58 72.39,57.34 | 72.39,57.34 C5.1 | U1.20 72.39,55.88 72.39,57.34
  Top 0.508: C4.1 40.95,41.59 40.01,40.64 J3.8 35.31,41.94 35.31,43.81 34.29,44.83 33.09,44.83 C2.1 U4.5 | C4.1 C3.1 | C4.1 43.81,43.96 X1.8
  Bottom 0.254: v33.66,25.4 36.6,28.35 J3.8
  Bottom 0.406: v46.1,45.72 50.04,49.66 53.28,49.66 64.19,60.58 v72.39,60.58
5V
  Top 0.254: 29.98,36.83 29.84,36.69 | R4.1 30.62,36.83 30.48,36.69
  Top 0.406: C6.2 C7.1 | U3.P$12 60.65,32.96 60.96,33.27 60.96,33.66 | U2.P$12 74.62,32.71 74.93,33.02 74.93,33.66
  Top 0.508: U4.1 23.75,44.77 C1.1 22.41,44.64 21.45,43.67 21.45,36.69
  Top 0.61: C13.+ 29.84,36.69 30.48,36.69 57.29,36.69 | 60.96,33.66 C9.2 | 74.93,33.66 C6.2
  Top 1.016: F1.2 12.57,27.81 21.45,36.69 C13.+ 57.29,36.69 57.85,36.13 C9.2 C10.1 74.8,36.13 C6.2
A_ISENSE0
  Top 0.305: U2.P$3 73.32,23.16 72.39,22.23 R6.2
A_ISENSE1
  Top 0.305: U3.P$3 59.35,23.16 58.42,22.23 R8.2
ADC
  Top 0.254: X1.2 40.6,56.48 40.01,55.88 J3.2
B_ISENSE0
  Top 0.305: U2.P$6 75.27,23.16 76.2,22.23 R7.2
B_ISENSE1
  Top 0.305: U3.P$6 61.3,23.16 62.23,22.23 R9.2
CH_PD
  Top 0.254: X1.3 41.14,54.48 40.01,53.34 J3.3 36.2,53.34 33.41,50.55 RN8.6
DTR
  Top 0.229: RN7.3 19.05,55.63
  Top 0.254: Q2.1 29.86,59.41 29.87,59.42 29.87,61.57 27.94,63.5 12.7,63.5 11.02,61.82 J15.3 10.79,61.59 12.57,59.82 16.3,59.82 17.91,58.21 17.91,56.3 18.59,55.62 19.01,55.62 19.02,55.63 19.05,55.63
GND  (via drill 0.35, 0.5)
  Top 0.229: RN9.5 71.11,58.81 71.12,58.8 | 85.47,34.92 RN2.2 | 85.98,34.67 RN2.3 | RN1.3 85.6,60.32 | RN1.2 86.1,60.32
  Top 0.254: X1.9 58.33,44.45 60.33,44.45 64.14,40.64 | U2.P$17 74.93,27.94 v75.82,27.05 | v72.77,27.05 v72.77,28.83 v72.76,28.84 | U3.P$17 61.21,27.05 v61.85,27.05 | v58.8,27.05 v58.8,28.83 v58.79,28.84 | U1.1 U1.2 U1.3 U1.4 U1.5 | 8.89,2.14 J1.SHLD8 | J1.GND 12.73,3.84 | 12.73,3.84 12.7,3.81 | 12.73,3.84 12.73,3.59 12.43,3.29 J1.SHLD7 | 57.15,59.56 59.18,59.56 | 44.96,59.56 42.55,59.56 | 77.47,51.18 v77.34,51.05 77.34,49.02 80.01,46.35 83.19,46.35 83.82,45.72 U1.10 | RN1.4 84.98,60.21 85.09,60.33 85.6,60.33 | 86.11,60.33 86.36,60.33 86.73,59.96 RN1.1 | 86.11,60.33 85.6,60.33 | 86.1,60.32 86.11,60.33 | 85.6,60.32 85.6,60.33 | RN2.1 84.85,35.04 85.22,34.67 85.47,34.67 | 85.47,34.67 85.98,34.67 86.36,34.67 86.61,34.92 86.61,36.37 RN2.4 | 85.47,34.92 85.47,34.67 | D4.C 12.57,54.48 10.79,52.7 J16.3
  Top 0.305: U3.P$17 60,28.27 U3.P$13 60,34.23 v59.41,34.82 | U2.P$17 73.97,28.27 U2.P$13 73.97,33.98 v73.72,34.23 | C5.2 74.48,57.15 | J1.SHLD5 J1.SHLD3
  Top 0.406: 12.73,6.7 J1.GND 12.73,3.59 | J1.SHLD3 18.01,2.14 | 16.27,4.84 J1.SHLD1 13.97,6.99 | J1.SHLD4 6.12,2.14 | J1.SHLD4 8.89,2.14 | 8.89,7.62 J1.SHLD2 7.23,4.84 6.99,5.08 | J1.SHLD4 7.93,3.5 7.62,3.81 | J1.SHLD3 14.93,3.5 15.24,3.81 | J1.SHLD6 J1.SHLD8 | J1.SHLD3 J1.SHLD7
  Top 0.508: C13.- v24.77,29.21 | U4.2 26.04,43.81
  Bottom 0.254: v75.82,27.05 v72.77,27.05 | v72.77,28.83 v75.82,28.83 | v61.85,27.05 v58.8,27.05 | v58.8,28.83 v61.85,28.83
  Bottom 0.406: J1.SHLD4 6.12,2.14 | 6.74,4.84 J1.SHLD2 8.88,6.97 8.89,6.99 | J1.SHLD3 17.38,2.14 | 16.12,4.84 J1.SHLD1 13.97,6.35 | J1.SHLD3 14.93,3.5 15.24,3.81 | J1.SHLD4 7.93,3.5 7.62,3.81 | J1.SHLD3 12.93,2.14 12.7,1.91 | J1.SHLD4 9.76,2.14 10.16,2.54
  other vias: 60.33,27.94 74.3,27.94 33.02,41.15 52.7,48.26 50.8,55.24 25.34,40.7 59.05,37.97 73.28,38.1 45.09,38.48 42.67,27.69 76.33,57.28 32.38,53.09 83.82,41.91
  pour Bottom (isolate 0.254, rank 6): -0.64,-0.64 -0.64,70.48 100.33,70.48 100.33,-0.64
  pour Top (isolate 0.254, rank 6): -1.27,-1.27 -1.27,71.12 100.97,71.12 100.97,-1.27
GPIO0  (via drill 0.35)
  Top 0.254: v45.72,55.88 46.35,55.88 47.62,57.15 54.61,57.15 56.52,55.24 56.52,50.8 56.84,50.48 X1.12 60.02,50.48 62.23,48.26 J4.5 | Q2.6 29.86,55.24 | 29.86,55.24 29.86,55.23 | FLASH.1 13.34,31.11 20.57,38.35 v20.57,41.2 | RN8.8 v30.3,54.61 30.3,54.81 29.86,55.24
  Bottom 0.254: v45.72,55.88 44.45,54.61 v30.3,54.61 30.3,49.83 21.66,41.2 v20.57,41.2
GPIO2  (via drill 0.35)
  Top 0.229: RN9.3 68.16,59.44 67.44,58.72
  Top 0.254: v52.7,50.4 54.38,50.4 56.3,48.48 X1.11 60.11,48.48 62.87,45.72 J4.6 66.67,47.85 66.67,52.22 67.44,52.98 67.44,58.72 | v62.61,62.87 R2.2
  Bottom 0.254: v52.7,50.4 53.19,50.4 61.85,59.06 61.85,62.48 62.23,62.87 v62.61,62.87
GPIO12  (via drill 0.35)
  Top 0.254: J3.6 40.01,45.72 42.76,48.48 X1.6 44.66,48.48 47.26,51.07 v47.75,51.07 | v62.23,66.17 62.74,66.67 R1.2
  Bottom 0.254: v47.75,51.07 48.53,51.07 49.02,51.56 52.91,51.56 60.83,59.48 60.83,64.77 v62.23,66.17
GPIO13  (via drill 0.35)
  Top 0.254: J3.7 38.73,43.18 42.03,46.48 X1.7 44.57,46.48 45.72,47.62 45.72,48.81 47.07,50.16 v47.88,50.16 | v62.87,64.77 66.41,64.77 R3.2
  Bottom 0.254: v47.88,50.16 48.34,50.16 49.23,51.05 53.13,51.05 61.34,59.27 61.34,63.25 v62.87,64.77
GPIO14  (via drill 0.35)
  Top 0.254: v47.62,52.07 47.54,52.07 45.95,50.48 X1.5 42.22,50.48 40.01,48.26 J3.5 34.92,48.26 33.26,49.92 RN8.5
  Bottom 0.254: v47.62,52.07 52.7,52.07 60.17,59.54 60.17,61.85 60.17,65.89 61.59,67.31 75.77,67.31 S1.3
GPIO15  (via drill 0.35)
  Top 0.254: v51.82,46.48 X1.10 60.2,46.48 63.5,43.18 J4.7 66.04,44.22 66.04,46.5 67.18,47.64 67.18,51.94 67.94,52.7 67.94,58.51 68.25,58.81 RN9.4 | U3.P$1 v56.52,25.14 52.33,25.14 51.82,25.65 v51.82,26.67 | U2.P$1 v70.87,25.15 70.87,23.5 69.33,21.96 R11.1
  Bottom 0.254: v51.82,26.67 v51.82,46.48 | v56.52,25.14 v70.86,25.14 v70.87,25.15
GPIO16
  Top 0.254: X1.4 41.68,52.48 40.01,50.8 J3.4
LED_B
  Top 0.254: R3.1 71.12,66.67 73.03,64.77 74.41,64.77 D1.3
LED_G
  Top 0.254: R1.1 66.67,66.67 67.94,67.94 70.74,67.94 73.03,65.66 75.95,65.66 76.75,64.86 D1.2
LED_R
  Top 0.254: D1.1 77.99,63.5 77.36,64.14 67.94,64.14 66.67,62.87 R2.1
MOT_0N  (via drill 0.35)
  Top 0.229: RN3.3 RN3.4
  Top 0.254: RN3.4 21.2,18.18 21.59,17.78 21.59,10.89 J6.GND
  Top 0.305: J10.1 60.92,10.2 55.75,15.37 v55.75,20.19 | v73.79,20.19 73.97,20.38 U2.P$4
  Bottom 0.254: J14.2 83.57,20.19 v73.79,20.19
  Bottom 0.305: J6.GND 20.41,9.62 21.59,10.79 21.59,20.95 23.5,22.86 53.09,22.86 v55.75,20.19 v73.79,20.19
MOT_0P  (via drill 0.35)
  Top 0.229: RN3.1 RN3.2
  Top 0.254: RN3.1 v19.45,18.18
  Top 0.305: U2.P$2 72.67,23.77 70.74,21.84 v70.74,20.88 | J10.3 54.32,22.06 54.31,22.07 54.31,23.19 v54.86,23.75
  Bottom 0.254: J14.1 81.96,20.88 v70.74,20.88 | v54.86,23.75 54.48,24.13 22.86,24.13 19.45,20.71 v19.45,18.18
  Bottom 0.305: v54.86,23.75 57.74,20.88 v70.74,20.88
MOT_1N  (via drill 0.35)
  Top 0.229: RN4.3 RN4.4
  Top 0.254: RN4.4 30.09,18.18 30.48,17.78 30.48,10.79 30.39,10.79 J7.GND
  Top 0.305: J11.1 71.08,17.11 v71.12,17.14 | U2.P$5 74.62,17.2 v74.68,17.14
  Bottom 0.254: v71.12,17.14 v74.68,17.14 85.6,17.14 J14.4
  Bottom 0.305: J7.GND 29.3,9.62 30.48,10.79 30.48,19.68 31.75,20.95 50.8,20.95 54.61,17.14 v71.12,17.14
MOT_1P  (via drill 0.35)
  Top 0.229: RN4.1 RN4.2
  Top 0.254: RN4.1 v28.34,18.18
  Top 0.305: U2.P$7 75.92,23.52 77.6,21.84 v77.6,18.8 | J11.3 64.48,18.17 v64.77,18.46
  Bottom 0.254: v64.77,18.46 55.83,18.46 52.07,22.23 31,22.23 28.34,19.56 v28.34,18.18 | J14.3 84.96,18.8 v77.6,18.8
  Bottom 0.305: v77.6,18.8 77.34,18.54 64.85,18.54 v64.77,18.46
MOT_2N  (via drill 0.35)
  Top 0.229: RN5.3 RN5.4
  Top 0.254: RN5.4 38.98,17.54 39.37,17.14 39.37,10.79 38.2,9.62 J8.GND
  Top 0.305: J12.1 81.24,14.01 v80.64,14.61 | U3.P$4 60,14.66 v59.94,14.61
  Bottom 0.254: J14.6 88.14,14.61 v80.64,14.61
  Bottom 0.305: v80.64,14.61 v59.94,14.61 53.34,14.61 49.53,18.41 40.64,18.41 39.37,17.14 39.37,10.79 38.2,9.62 J8.GND
MOT_2P  (via drill 0.35)
  Top 0.229: RN5.1 RN5.2
  Top 0.254: RN5.1 v37.23,18.05
  Top 0.305: U3.P$2 58.7,23.77 57.02,22.1 v57.02,15.97 | J12.3 74.64,15.63 v74.3,15.97
  Bottom 0.254: v57.02,15.97 54.51,15.97 50.16,20.32 39.5,20.32 v37.23,18.05 | J14.5 87.22,15.97 v74.3,15.97
  Bottom 0.305: v74.3,15.97 v57.02,15.97
MOT_3N  (via drill 0.35)
  Top 0.229: RN6.3 RN6.4
  Top 0.254: RN6.4 47.79,17.61 48.26,17.14 48.26,10.79 47.09,9.62 J9.GND
  Top 0.305: v62.23,12.02 60.65,13.6 U3.P$5
  Bottom 0.254: 90.81,12.06 90.81,12.19 J14.8
  Bottom 0.305: J13.1 91.4,11.47 90.81,12.06 62.23,12.06 | J9.GND 49.44,12.06 62.23,12.06 | 62.23,12.06 v62.23,12.02
MOT_3P  (via drill 0.35)
  Top 0.229: RN6.1 RN6.2
  Top 0.254: RN6.1 v46.19,17.73
  Top 0.305: U3.P$7 61.95,23.77 63.5,22.23 v63.5,13.38 | J13.3 84.8,13.35 v84.84,13.38
  Bottom 0.254: v63.5,13.38 50.12,13.38 48.26,15.24 48.26,16.51 47.04,17.73 v46.19,17.73 | v84.84,13.38 85.3,13.84 90.17,13.84 J14.7
  Bottom 0.305: v84.84,13.38 v63.5,13.38
N$1
  Top 0.254: U4.3 27.27,40.67 27.94,40.01 R4.2
N$2
  Top 0.229: RN1.8 86.73,57.16
  Top 0.254: D5.C 87.38,56.52 86.73,57.16
N$3
  Top 0.229: RN1.7 86.1,54.87
  Top 0.254: 86.1,54.87 87,53.98 D6.C
N$4
  Top 0.813: Q1.3 3.98,17.95 5.84,19.81 J2.1
N$5
  Top 0.813: 12.83,19.18 F1.1 9.91,19.43 7.93,17.46 Q1.2
  Top 1.016: D2.C 13.2,18.81 12.83,19.18
N$6
  Top 0.229: RN1.6 85.6,53.46
  Top 0.254: D7.C 87.63,51.44 85.6,53.46
N$7
  Top 0.229: RN1.5 84.98,52.18
  Top 0.254: 84.98,52.18 88.27,48.9 D8.C
N$8
  Top 0.229: 85.09,43.18 84.85,42.94 RN2.8
  Top 0.254: 85.09,43.18 88.27,46.35 D9.C
N$9
  Top 0.229: RN2.7 85.47,41.66
  Top 0.254: 85.47,41.66 87.63,43.81 D10.C
N$10
  Top 0.229: RN2.6 85.97,40.26
  Top 0.254: 85.97,40.26 87,41.27 D11.C
N$11
  Top 0.229: RN2.5 86.6,38.09
  Top 0.254: 88.9,38.52 D12.C 87.25,38.73 86.6,38.09
N$12
  Top 0.254: D1.4 72.3,63.41 71.75,62.87 R10.1
N$13
  Top 0.254: R11.2 D3.A
N$14  (via drill 0.35)
  Top 0.305: v90.55,13.08 90.55,11.81 J13.2
  Bottom 0.305: J9.VBUS 49.91,12.7 90.17,12.7 v90.55,13.08
N$15
  Top 0.229: RN3.7 20.07,21.84 19.37,22.54 D21.C
N$16
  Top 0.254: RN3.8 19.45,21.2 17.46,23.18 D13.A
N$17
  Top 0.229: RN3.6 20.57,21.84 21.27,22.54 D14.A
N$18
  Top 0.254: RN4.8 28.34,21.2 26.35,23.18 D15.A
N$19
  Top 0.229: RN4.6 29.46,21.84 30.16,22.54 D16.A
N$20
  Top 0.254: RN5.8 37.23,21.2 35.24,23.18 D17.A
N$21
  Top 0.229: RN5.6 38.35,21.84 39.05,22.54 D18.A
N$22
  Top 0.254: RN6.8 46.19,21.12 44.13,23.18 D19.A
N$23
  Top 0.229: RN6.6 47.24,21.84 47.94,22.54 D20.A
N$24
  Top 0.254: RN3.5 21.2,21.2 23.18,23.18 D22.C
N$25
  Top 0.229: RN4.7 28.96,21.84 28.26,22.54 D23.C
N$26
  Top 0.254: RN4.5 30.09,21.2 32.07,23.18 D24.C
N$27
  Top 0.254: RN6.5 47.79,21.12 49.85,23.18 D28.C
N$28
  Top 0.229: RN6.7 46.74,21.84 46.04,22.54 D27.C
N$29
  Top 0.254: RN5.5 38.98,21.2 40.96,23.18 D26.C
N$30
  Top 0.229: RN5.7 37.85,21.84 37.15,22.54 D25.C
N$32  (via drill 0.35)
  Top 0.305: J10.2 54.99,13.59 v54.99,22.35
  Bottom 0.305: v54.99,22.35 53.85,23.5 23.34,23.5 20.32,20.48 J6.VBUS
N$33  (via drill 0.35)
  Top 0.305: v68.58,17.83 J11.2
  Bottom 0.305: J7.VBUS 29.21,19.68 31.11,21.59 51.44,21.59 55.24,17.78 68.53,17.78 v68.58,17.83
N$34  (via drill 0.35)
  Top 0.305: J12.2 v78.74,15.29
  Bottom 0.305: v78.74,15.29 53.93,15.29 50.16,19.05 46.35,19.05 40.01,19.05 38.1,17.14 J8.VBUS
N$35  (via drill 0.35)
  Top 0.229: RN7.8 21.42,56.77 v24.64,56.77
  Top 0.254: Q2.2 v29.21,59.69
  Bottom 0.254: v29.21,59.69 27.56,59.69 v24.64,56.77
N$36
  Top 0.229: RN7.6 21.42,55.65 23.35,55.65 24.26,54.74
  Top 0.254: Q2.5 29.21,55.24 28.57,54.61 24.38,54.61 24.26,54.74
PWM0  (via drill 0.35)
  Top 0.254: D5.A J5.1 | U2.P$16 71.5,31.26 v71.5,32.89 | v78.74,41.91 U1.6
  Bottom 0.254: J5.1 94.61,56.52 93.34,55.24 93.34,54.56 92.84,54.05 92.84,51.01 92.5,50.67 85.14,50.67 78.74,44.28 v78.74,41.91 78.74,35.56 78.74,35.31 76.33,32.89 v71.5,32.89
PWM1  (via drill 0.35)
  Top 0.254: D6.A J5.2 | U2.P$15 72.67,32.1 v72.64,32.13 | v80.01,41.91 U1.7
  Bottom 0.254: v72.64,32.13 76.45,32.13 80.01,35.69 v80.01,41.91 80.01,44.83 85.35,50.16 92.71,50.16 93.34,50.8 93.34,52.83 J5.2
PWM2  (via drill 0.35)
  Top 0.254: J5.3 D7.A | U2.P$9 77.09,30.74 v77.47,31.11 | v81.28,41.91 U1.8
  Bottom 0.254: v77.47,31.11 77.47,32.38 81.28,36.2 v81.28,41.91 81.28,45.38 85.43,49.53 92.84,49.53 J5.3
PWM3  (via drill 0.35)
  Top 0.254: D8.A J5.4 | U2.P$10 75.92,32.1 76.2,32.38 v78.74,32.38 | v82.55,41.91 U1.9
  Bottom 0.254: J5.4 85.72,48.9 82.55,45.72 v82.55,41.91 82.55,36.75 78.74,32.94 v78.74,32.38
PWM4  (via drill 0.35)
  Top 0.254: D9.A J5.5 93.47,47.62 88.01,47.62 v83.82,51.82 U1.11 | U3.P$16 57.53,31.26 v57.53,33.27
  Bottom 0.254: v57.53,33.27 58.42,34.16 63.12,34.16 80.78,51.82 v83.82,51.82
PWM5  (via drill 0.35)
  Top 0.254: D10.A J5.6 | U3.P$15 58.7,32.28 v58.38,32.6 | U1.12 v82.55,51.16 83.55,51.16 v86.47,48.24
  Bottom 0.254: v58.38,32.6 59.44,33.66 63.33,33.66 80.84,51.16 v82.55,51.16 | J5.6 93.34,44.96 93.34,46.99 92.08,48.26 86.49,48.26 v86.47,48.24
PWM6  (via drill 0.35)
  Top 0.254: D11.A J5.7 | U1.13 v81.28,50.5 82.59,50.5 v85.6,47.5 | U3.P$9 63.15,30.74 v63.75,31.35
  Bottom 0.254: v81.28,50.5 80.9,50.5 63.75,33.36 v63.75,31.35 | J5.7 92.84,43.18 92.84,46.78 91.86,47.75 87.65,47.75 87.4,47.5 v85.6,47.5
PWM7  (via drill 0.35)
  Top 0.254: D12.A J5.8 | U1.14 80.01,49.53 v80.43,49.11 80.86,49.53 82.85,49.53 84.45,47.92 84.45,47.12 v84.84,46.74 | U3.P$10 61.95,31.6 62.36,32 v65.02,32
  Bottom 0.254: v80.43,49.11 80.22,49.11 65.02,33.91 v65.02,32 | J5.8 93.34,39.88 93.34,41.95 92.33,42.97 92.33,46.57 91.65,47.24 87.86,47.24 87.46,46.84 84.94,46.84 v84.84,46.74
PWR_LED
  Top 0.254: RN7.4 18.81,55.01 18.29,54.48 D4.A
RESET  (via drill 0.35)
  Top 0.229: RN8.7 32.86,51.05 v33.02,51.21
  Top 0.254: X1.1 43.24,58.42 J3.1 36.83,58.42 34.92,56.52 34.92,53.11 v33.02,51.21 32.87,51.06 | 28.57,58.09 Q2.3 28.56,58.69 28.19,59.05 27.96,59.05 v27.94,59.03 | 10.79,36.22 RESET.1 17.7,36.2 19.92,38.41 v19.92,40.39
  Bottom 0.254: v33.02,51.21 32.39,51.21 21.72,40.54 20.07,40.54 v19.92,40.39 | v27.94,59.03 28.55,58.42 J3.1
RTS
  Top 0.254: RN7.1 19.45,56.76 19.05,57.15 19.05,57.53 | 19.05,57.53 19.05,59.05 19.68,59.69 20.32,59.69 20.95,60.33 J15.7 | Q2.4 26.57,56.23 25.27,57.53 19.05,57.53
RXD0  (via drill 0.35)
  Top 0.229: RN7.7 23.88,56.13 24.13,55.88
  Top 0.254: v45.72,57.15 46.35,57.15 46.99,57.78 55.24,57.78 56.55,56.48 X1.15 61,56.48 61.59,55.88 J4.2 | 24.13,55.88 24.77,55.24 25.89,55.24 v25.91,55.27
  Bottom 0.254: v45.72,57.15 34.29,57.15 33.27,56.13 29.46,56.13 28.6,55.27 v25.91,55.27
SCL  (via drill 0.35)
  Top 0.254: X1.14 60.46,54.48 61.59,53.34 J4.3 66.15,54.5 66.17,54.51 66.42,54.76 66.42,59.18 67.8,60.56 RN9.1 | v74.93,51.56 U1.18
  Bottom 0.254: J4.3 66.78,51.56 v74.93,51.56
SDA  (via drill 0.35)
  Top 0.229: RN9.2 67.94,59.94 66.93,58.93
  Top 0.254: X1.13 59.92,52.48 61.59,50.8 J4.4 66.93,53.19 66.93,58.93 | v73.66,50.8 U1.19
  Bottom 0.254: J4.4 v73.66,50.8
TXD0  (via drill 0.35)
  Top 0.254: 58.24,58.42 X1.16 58.35,58.42 | v46.35,58.42 58.35,58.42 | J4.1 58.35,58.42
  Bottom 0.254: v46.35,58.42 40.64,58.42 38.1,60.96 26.04,60.96 24.77,59.69 20.09,59.69 J15.6 16.51,59.46 16.51,51.44 17.14,50.8 17.14,45.09 FTDI.5
USB_RXD
  Top 0.229: RN7.2 18.8,56.13
  Top 0.254: 18.8,56.13 18.41,56.52 18.41,58.42 15.88,60.96 J15.5
  Bottom 0.254: FTDI.4 14.61,44.83 14.61,50.16 15.88,51.44 J15.5
V_USB
  Top 0.254: Q1.1 8.95,15.56 R5.2 8.9,15.51 D2.A
  Top 0.508: 10.13,5.71 J1.VBUS
  Top 0.61: 10.13,6.35 10.13,5.71
  Top 0.813: 10.13,6.35 10.13,8.86 8.9,10.09 D2.A 5.08,12.06 2.29,14.86 2.29,40.64 | 2.29,40.64 2.29,47.37 4.04,49.12 J16.1 | FTDI.3 10.79,42.55 8.89,40.64 2.29,40.64
VCP0
  Top 0.305: U2.P$11 75.27,32.38 77.24,34.36 C7.2
VCP1
  Top 0.305: U3.P$11 61.3,32.73 62.8,34.23 C10.2
VINT0
  Top 0.305: U2.P$14 73.32,32.73 71.5,34.54 C8.2
VINT1
  Top 0.305: U3.P$14 59.35,32.98 58.04,34.29 C11.2

### Text on the board
tPlace: VihHub Dev Board v1.1 | Kadah - June 2018 | SPFMDB | PWM | GND | VCC | TXD | RXD | Black | Green | Ch. 0 | Ch. 1 | Ch. 2 | Ch. 3 | B- | Motors | + | - | + | - | + | - | + | - | + | - | + | - | + | - | + | - | B+ | Ch. 0 | Ch. 1 | Ch. 2 | Ch. 3